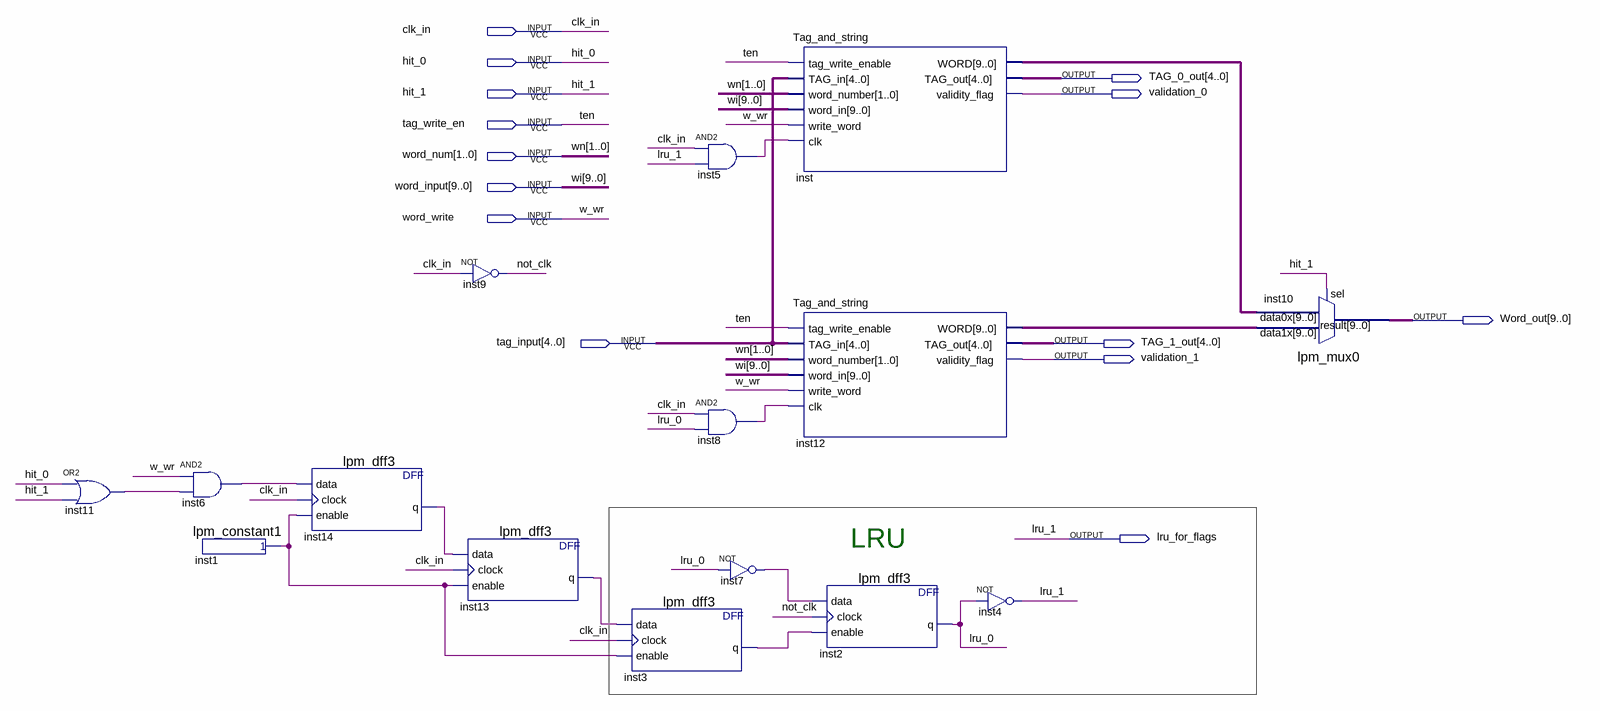
[diagram p0: schematic sheet]
// Quartus schematic One_Set.bdf as structural Verilog: 15 symbols, 14 pins
module One_Set (
  input  clk_in,
  input  hit_0,
  input  hit_1,
  input  tag_write_en,
  input  [1:0] word_num,
  input  [9:0] word_input,
  input  word_write,
  input  [4:0] tag_input,
  output [4:0] TAG_0_out,
  output validation_0,
  output [9:0] Word_out,
  output [4:0] TAG_1_out,
  output validation_1,
  output lru_for_flags
);

  wire inst1_result, inst3_q, inst5_out, inst6_out, inst7_out, inst8_out, inst11_out, inst13_q, inst14_q,
       lru_0, not_clk;
  wire [9:0] inst12_word, inst_word;

  or inst11 (inst11_out, hit_0, hit_1);
  and inst6 (inst6_out, word_write, inst11_out);
  lpm_constant1 inst1 (.result(inst1_result));
  lpm_dff3 inst14 (.data(inst6_out), .clock(clk_in), .enable(inst1_result), .q(inst14_q));
  not inst9 (not_clk, clk_in);
  lpm_dff3 inst13 (.data(inst14_q), .clock(clk_in), .enable(inst1_result), .q(inst13_q));
  lpm_dff3 inst3 (.data(inst13_q), .clock(clk_in), .enable(inst1_result), .q(inst3_q));
  and inst5 (inst5_out, clk_in, lru_for_flags);
  and inst8 (inst8_out, clk_in, lru_0);
  not inst7 (inst7_out, lru_0);
  Tag_and_string inst (
    .tag_write_enable(tag_write_en), .TAG_in(tag_input), .word_number(word_num), .word_in(word_input),
    .write_word(word_write), .clk(inst5_out), .WORD(inst_word), .TAG_out(TAG_0_out),
    .validity_flag(validation_0));
  Tag_and_string inst12 (
    .tag_write_enable(tag_write_en), .TAG_in(tag_input), .word_number(word_num), .word_in(word_input),
    .write_word(word_write), .clk(inst8_out), .WORD(inst12_word), .TAG_out(TAG_1_out),
    .validity_flag(validation_1));
  lpm_dff3 inst2 (.data(inst7_out), .clock(not_clk), .enable(inst3_q), .q(lru_0));
  not inst4 (lru_for_flags, lru_0);
  lpm_mux0 inst10 (.data1x(inst12_word), .data0x(inst_word), .sel(hit_1), .result(Word_out));

  // Other names for the same wires on the sheet: lru_1 = lru_for_flags; ten = tag_write_en; w_wr = word_write;
  //   wi[9:0] = word_input; wn[1:0] = word_num

  // Notes on the sheet:
  //   LRU
endmodule
